# EAGLE design classdamp (EAGLE 6.4)
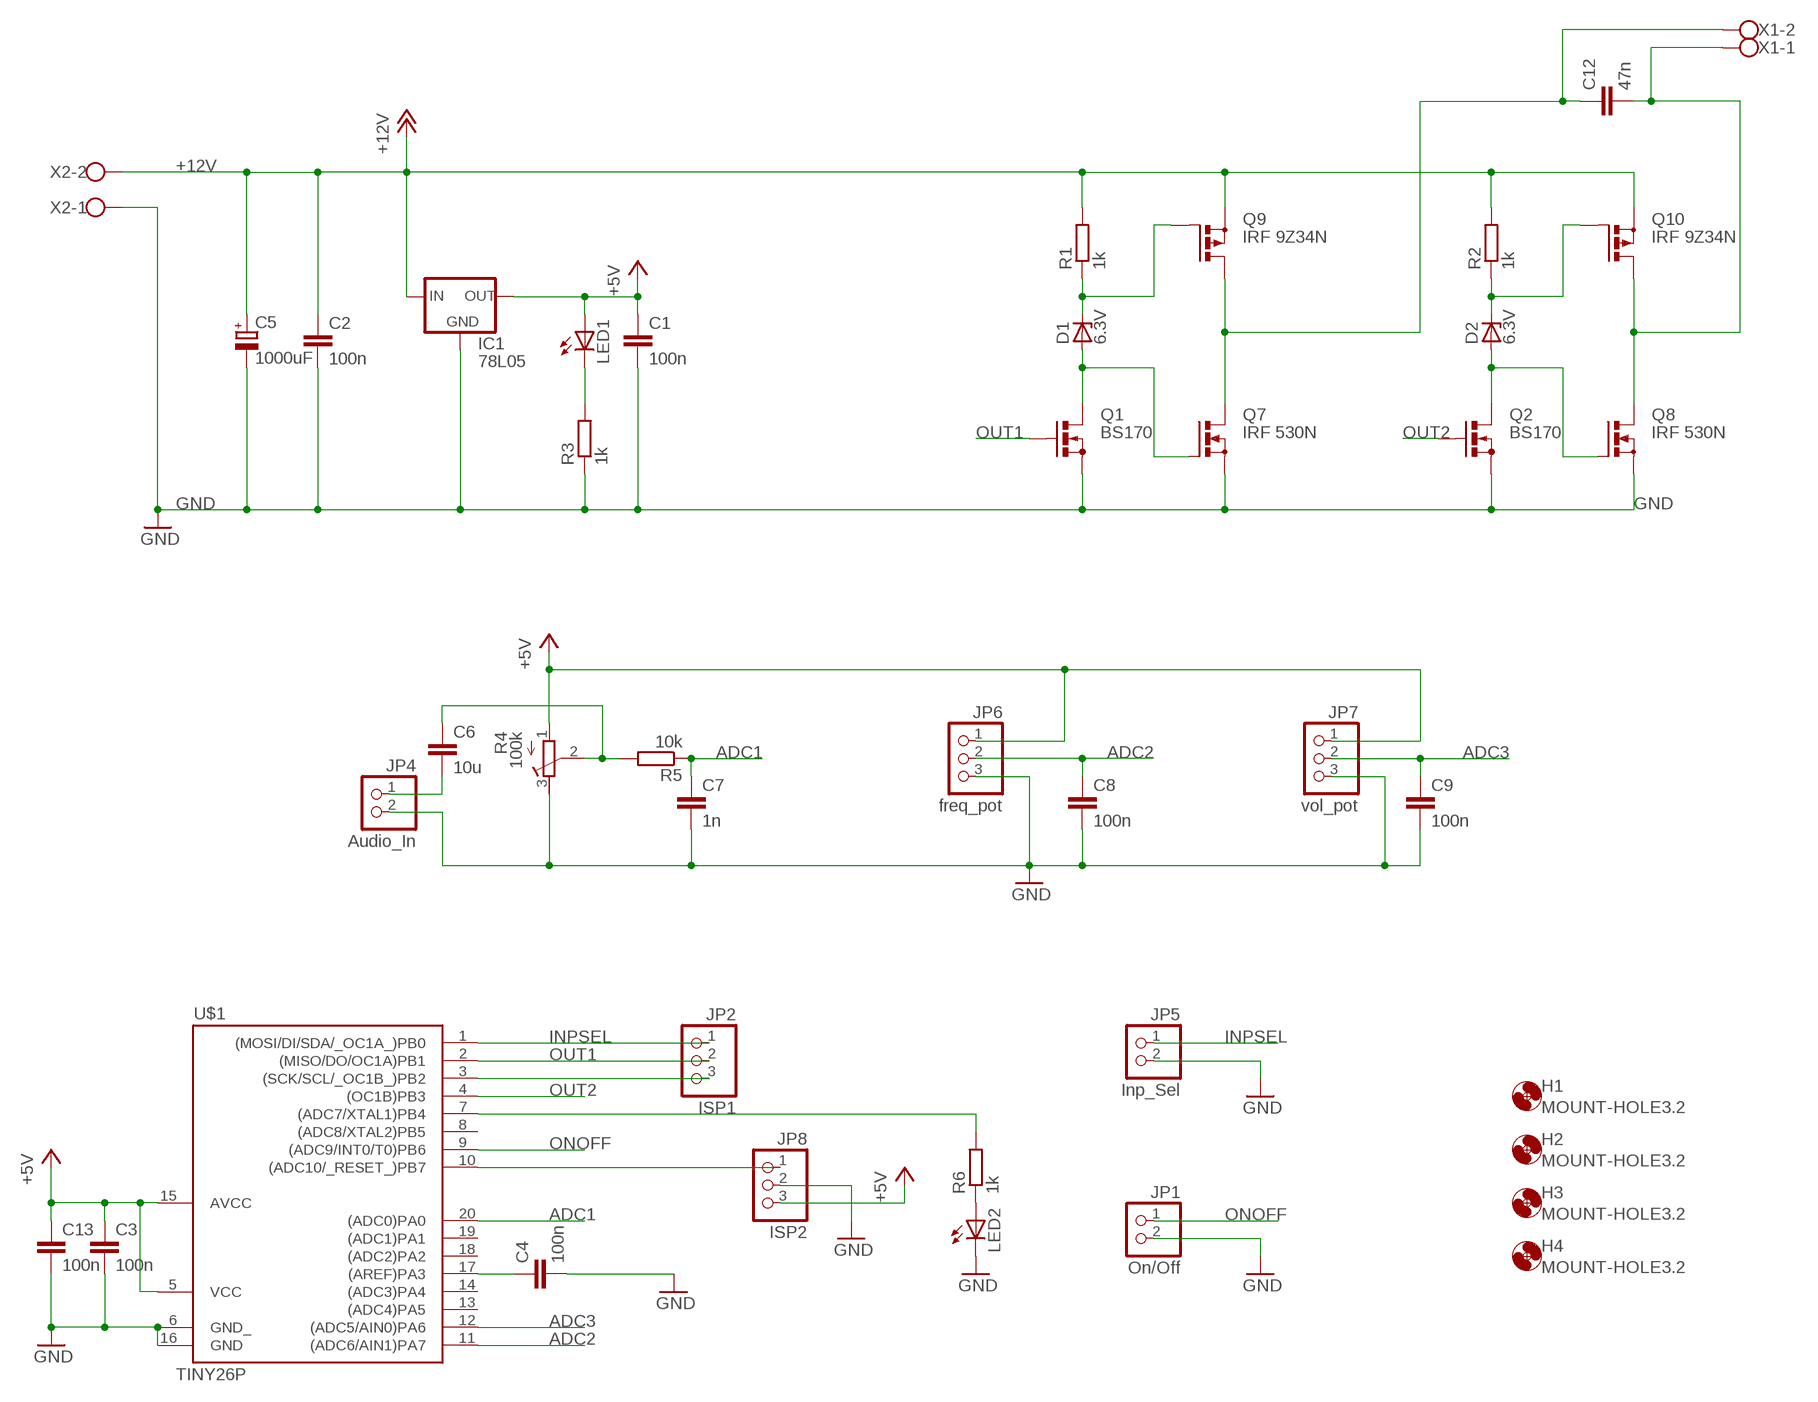
[diagram p0: schematic, sheet 1]

## Parts
C1  100n  C-EUC0805K  [C0805K]
C2  100n  C-EUC0805K  [C0805K]
C3  100n  C-EUC0805K  [C0805K]
C4  100n  C-EUC0805K  [C0805K]
C5  1000uF  CPOL-EUE5-8.5  [E5-8,5]
C6  10u  C-EUC0805K  [C0805K]
C7  1n  C-EUC0805K  [C0805K]
C8  100n  C-EUC0805K  [C0805K]
C9  100n  C-EUC0805K  [C0805K]
C12  47n  C5/3.5  [C5B3.5]
C13  100n  C-EUC0805K  [C0805K]
D1  6.3V  ZENER-DIODEZD-5  [ZDIO-5]
D2  6.3V  ZENER-DIODEZD-5  [ZDIO-5]
H1  MOUNT-HOLE3.2  [3,2]
H2  MOUNT-HOLE3.2  [3,2]
H3  MOUNT-HOLE3.2  [3,2]
H4  MOUNT-HOLE3.2  [3,2]
IC1  78L05  78LXX  [78LXX]
JP1  On/Off  PINHD-1X2  [1X02]
JP2  ISP1  PINHD-1X3  [1X03]
JP4  Audio_In  PINHD-1X2  [1X02]
JP5  Inp_Sel  PINHD-1X2  [1X02]
JP6  freq_pot  PINHD-1X3  [1X03]
JP7  vol_pot  PINHD-1X3  [1X03]
JP8  ISP2  PINHD-1X3  [1X03]
LED1  LEDSML0805  [SML0805]
LED2  LEDSML0805  [SML0805]
Q1  BS170  [SOT54E]
Q2  BS170  [SOT54E]
Q7  IRF 530N  PMOSFET_NTO220BV  [TO220BV]
Q8  IRF 530N  PMOSFET_NTO220BV  [TO220BV]
Q9  IRF 9Z34N  PMOSFET_PTO220BV  [TO220BV]
Q10  IRF 9Z34N  PMOSFET_PTO220BV  [TO220BV]
R1  1k  R-EU_R0805  [R0805]
R2  1k  R-EU_R0805  [R0805]
R3  1k  R-EU_R0805  [R0805]
R4  100k  R-TRIMM64W  [RTRIM64W]
R5  10k  R-EU_R0805  [R0805]
R6  1k  R-EU_R0805  [R0805]
U$1  TINY26P  [DIL20]
X1  W237-102  [W237-102]
X2  W237-102  [W237-102]

## Nets
+5V: C1.1 C3.1 C13.1 IC1.OUT JP6.1 JP7.1 JP8.3 LED1.A R4.1(E) U$1.5(VCC) U$1.15(AVCC)
+12V: C2.1 C5.+ IC1.IN Q9.S Q10.S R1.2 R2.2 X2.2
ADC1: C7.1 R5.1 U$1.20((ADC0)PA0)
ADC2: C8.1 JP6.2 U$1.11((ADC6/AIN1)PA7)
ADC3: C9.1 JP7.2 U$1.12((ADC5/AIN0)PA6)
GND: C1.2 C2.2 C3.2 C4.2 C5.- C7.2 C8.2 C9.2 C13.2 IC1.GND JP1.2 JP4.2 JP5.2 JP6.3 JP7.3 JP8.2 LED2.C Q1.S Q2.S Q7.S Q8.S R3.1 R4.3(A) U$1.6(GND_) U$1.16(GND) X2.1
INPSEL: JP2.1 JP5.1 U$1.1((MOSI/DI/SDA/_OC1A_)PB0)
N$1: LED1.C R3.2
N$2: C4.1 U$1.17((AREF)PA3)
N$3: LED2.A R6.1
N$4: D1.A Q1.D Q7.G
N$5: D2.A Q2.D Q8.G
N$6: D1.C Q9.G R1.1
N$7: D2.C Q10.G R2.1
N$8: C6.2 JP4.1
N$9: JP2.3 U$1.3((SCK/SCL/_OC1B_)PB2)
N$10: C6.1 R4.2(S) R5.2
N$11: C12.1 Q7.D Q9.D X1.2
N$12: JP8.1 U$1.10((ADC10/_RESET_)PB7)
N$13: C12.2 Q8.D Q10.D X1.1
N$14: R6.2 U$1.7((ADC7/XTAL1)PB4)
ONOFF: JP1.1 U$1.9((ADC9/INT0/T0)PB6)
OUT1: JP2.2 Q1.G U$1.2((MISO/DO/OC1A)PB1)
OUT2: Q2.G U$1.4((OC1B)PB3)
Unconnected: U$1.8((ADC8/XTAL2)PB5) U$1.13((ADC4)PA5) U$1.14((ADC3)PA4) U$1.18((ADC2)PA2) U$1.19((ADC1)PA1)

## Library data of the parts
C1-C4 C6-C9 C13 = resistor:C-EU: CAPACITOR, European symbol
C5 = resistor:CPOL-EU: POLARIZED CAPACITOR, European symbol
C12 = capacitor-wima:C: CAPACITOR naming: grid - package width
D1 D2 = diode:ZENER-DIODE: Z-Diode
H1-H4 = holes:MOUNT-HOLE: MOUNTING HOLE with drill center marker
IC1 = v-reg:78LXX: VOLTAGE REGULATOR
JP1 JP4 JP5 = pinhead:PINHD-1X2: PIN HEADER
JP2 JP6-JP8 = pinhead:PINHD-1X3: PIN HEADER
LED1 LED2 = led:LED: LED OSRAM: - CHIPLED LG R971, LG N971, LY N971, LG Q971, LY Q971, LO R971, LY R971 LH N974, LH R974 LS Q976, LO Q976, LY Q976 LO Q996 - Hyper CHIPLED LW Q18S LB Q993, LB Q99A, LB R99A - SideLED LS A670, LO A670, LY A670, LG A670, LP A670 LB A673, LV A673, LT A673, LW A673 LH A674 LY A675 LS A676, LA A676, LO A676, LY A676, LW A676 LS A679, LY A679, LG A679 - Hyper Micro SIDELED® LS Y876, LA Y876, LO Y876, LY Y876 LT Y87S - SmartLED LW L88C, LW L88S LB L89C, LB L89S, LG L890 LS L89K, LO L89K, LY L89K LS L896, LA L896, LO L896, LY L896 - TOPLED LS T670, LO T670, LY T670, LG T670, LP T670 LSG T670, LSP T670, LSY T670, LOP T670, LYG T670 LG T671, LOG T671, LSG T671 LB T673, LV T673, LT T673, LW T673 LH T674 LS T676, LA T676, LO T676, LY T676, LB T676, LH T676, LSB T676, LW T676 LB T67C, LV T67C, LT T67C, LS T67K, LO T67K, LY T67K, LW E67C LS E67B, LA E67B, LO E67B, LY E67B, LB E67C, LV E67C, LT E67C LW T67C LS T679, LY T679, LG T679 LS T770, LO T770, LY T770, LG T770, LP T770 LB T773, LV T773, LT T773, LW T773 LH T774 LS E675, LA E675, LY E675, LS T675 LS T776, LA T776, LO T776, LY T776, LB T776 LHGB T686 LT T68C, LB T68C - Hyper Mini TOPLED® LB M676 - Mini TOPLED Santana® LG M470 LS M47K, LO M47K, LY M47K Source: http://www.osram.convergy.de LUXEON: - LUMILED® LXK2-PW12-R00, LXK2-PW12-S00, LXK2-PW14-U00, LXK2-PW14-V00 LXK2-PM12-R00, LXK2-PM12-S00, LXK2-PM14-U00 LXK2-PE12-Q00, LXK2-PE12-R00, LXK2-PE12-S00, LXK2-PE14-T00, LXK2-PE14-U00 LXK2-PB12-K00, LXK2-PB12-L00, LXK2-PB12-M00, LXK2-PB14-N00, LXK2-PB14-P00, LXK2-PB14-Q00 LXK2-PR12-L00, LXK2-PR12-M00, LXK2-PR14-Q00, LXK2-PR14-R00 LXK2-PD12-Q00, LXK2-PD12-R00, LXK2-PD12-S00 LXK2-PH12-R00, LXK2-PH12-S00 LXK2-PL12-P00, LXK2-PL12-Q00, LXK2-PL12-R00 Source: www.luxeon.com KINGBRIGHT: KA-3528ASYC Source: www.kingbright.com
Q1 Q2 = transistor-small-signal:BS170: N-CHANNEL MOS FET
Q7 Q8 = transistor-power:PMOSFET_N: Power MOSFET N-Channel
Q9 Q10 = transistor-power:PMOSFET_P: Power MOSFET P-Channel
R1-R3 R5 R6 = resistor:R-EU_: RESISTOR, European symbol
R4 = resistor:R-TRIMM: Trimm resistor
U$1 = avr-7:TINY26: Atmel Tiny26/261/461/861
X1 X2 = con-wago-500:W237-102: WAGO SCREW CLAMP; MPN: 237-102; OC_FARNELL: unknown; OC_NEWARK: 70K9898

## Board
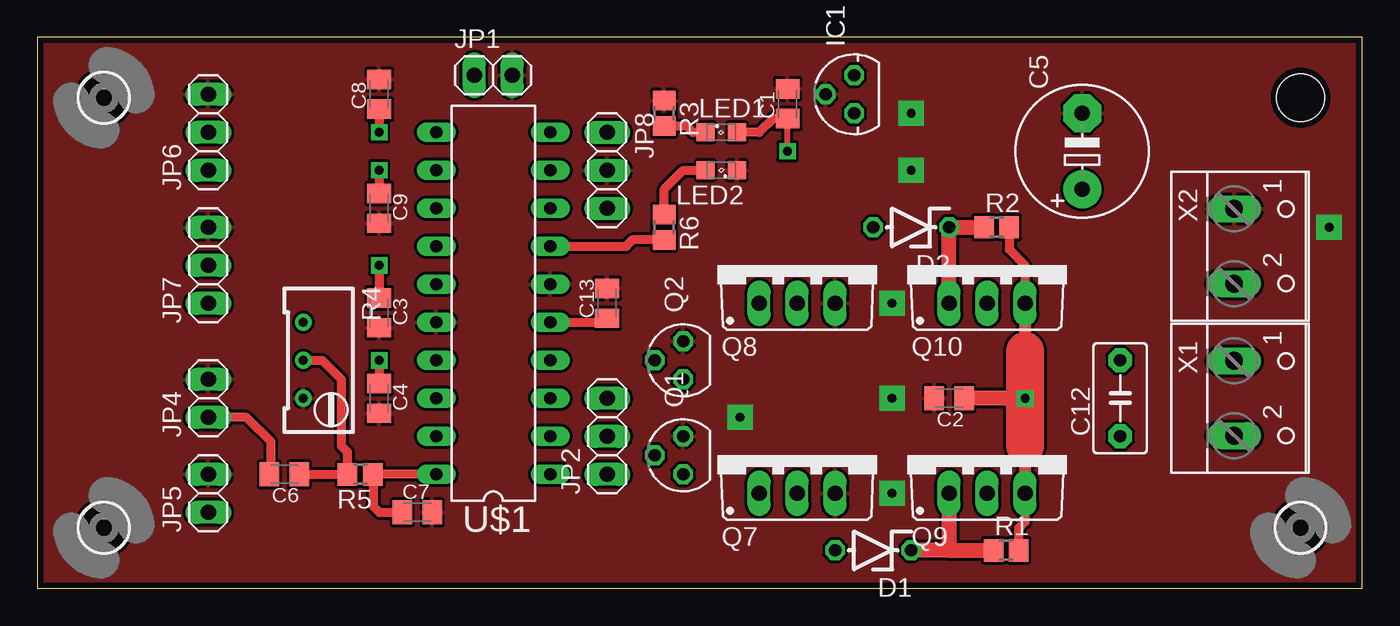
[diagram p1: board, top side]
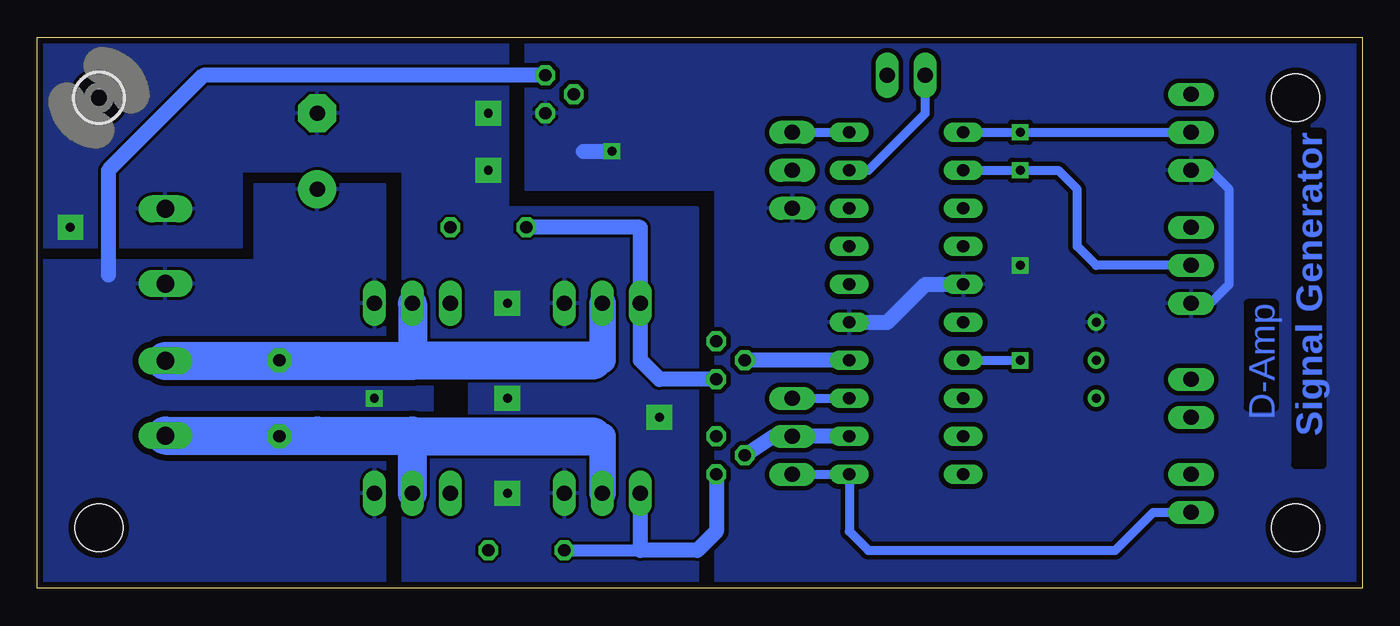
[diagram p2: board, bottom side, seen from below]

Size 88.57 x 36.82 mm. Coordinates in mm from the lower left corner, seen from the top.
Outline: 0,0 88.57,0 88.57,36.82 0,36.82 0,0
Copper layers (1*16): Top 0.035mm / dielectric 1.5mm / Bottom 0.035mm
Design rules "pcb-devboards_Standard": minimum track width 0.2mm, minimum drill 0.4mm, track to track 0.2mm, track to pad 0.2mm, pad to pad 0.2mm, via to via 0.2mm, smd to smd 0.2mm, copper to edge 0.4mm, drill to drill 0.2mm, minimum pad ring 0.25mm, minimum via ring 0.25mm, stop-mask expansion 0.1mm, vias tented up to drill 0mil, thermal gap 0.2mm

### Footprints (pad centres in the part's own frame; a part is rotated, then mirrored left to right if it is on the bottom)
C0805K = smd 1.3 x 1.6: 1 -1,0; 2 1,0
E5-8,5 = drill 1.016 pad 2.54: + -2.54,0 | drill 1.016 pad 2.54 octagon: - 2.54,0
C5B3.5 = drill 0.813 pad 1.6 octagon: 1 -2.54,0; 2 2.54,0
ZDIO-5 = drill 0.813 octagon: A 2.54,0; C -2.54,0
3,2 = hole 3.2: 0,0
78LXX = drill 0.813 octagon: GND 0,1.905; IN 1.27,0; OUT -1.27,0
1X02 = drill 1.016 long: 1 -1.27,0; 2 1.27,0
1X03 = drill 1.016 long: 1 -2.54,0; 2 0,0; 3 2.54,0
SML0805 = smd 1.2 x 1.2: A 1.05,0; C -1.05,0
SOT54E = drill 0.813 octagon: D -1.27,0; G 0,1.905; S 1.27,0
TO220BV = drill 1.016 long: D 0,-2.54; G -2.54,-2.54; S 2.54,-2.54
R0805 = smd 1.3 x 1.5: 1 -0.85,0; 2 0.85,0
RTRIM64W = drill 0.61: 1 1.27,-2.54; 2 1.27,0; 3 1.27,2.54
DIL20 = drill 0.813 long: 1 -11.43,-3.81; 2 -8.89,-3.81; 3 -6.35,-3.81; 4 -3.81,-3.81; 5 -1.27,-3.81; 6 1.27,-3.81; 7 3.81,-3.81; 8 6.35,-3.81; 9 8.89,-3.81; 10 11.43,-3.81; 11 11.43,3.81; 12 8.89,3.81; 13 6.35,3.81; 14 3.81,3.81; 15 1.27,3.81; 16 -1.27,3.81; 17 -3.81,3.81; 18 -6.35,3.81; 19 -8.89,3.81; 20 -11.43,3.81
W237-102 = drill 1.194 long: 1 -2.5,-1.27; 2 2.5,-1.27

### Placement (x,y rotation side)
C1  50.16,32.38 90 top
C2  60.96,12.7 180 top
C3  22.86,18.41 270 top
C4  22.86,12.7 270 top
C5  69.85,29.21 90 top
C6  16.51,7.62 180 top
C7  25.4,5.08 0 top
C8  22.86,33.02 90 top
C9  22.86,25.4 270 top
C12  72.39,12.7 90 top
C13  38.1,19.05 90 top
D1  55.88,2.54 180 top
D2  58.42,24.13 180 top
H1  4.45,32.78 0 top
H2  84.45,32.78 0 bottom
H3  84.45,4.04 0 top
H4  4.45,4.04 0 top
IC1  54.61,33.02 90 top
JP1  30.48,34.29 0 top
JP2  38.1,10.16 90 top
JP4  11.43,12.7 90 top
JP5  11.43,6.35 90 top
JP6  11.43,30.48 90 top
JP7  11.43,21.59 90 top
JP8  38.1,27.94 270 top
LED1  45.72,30.48 0 top
LED2  45.72,27.94 180 top
Q1  43.18,8.89 90 top
Q2  43.18,15.24 90 top
Q7  50.8,8.89 0 top
Q8  50.8,21.59 0 top
Q9  63.5,8.89 0 top
Q10  63.5,21.59 0 top
R1  64.77,2.54 0 top
R2  64.14,24.13 0 top
R3  41.91,31.75 270 top
R4  19.05,15.24 180 top
R5  21.59,7.62 180 top
R6  41.91,24.13 270 top
U$1  30.48,19.05 90 top
X1  81.28,12.7 270 top
X2  81.28,22.86 270 top

### Tracks (layer width: path | path; a pad name or v marks a point on that pad's centre or on a via)
+5V  (via drill 0.6, 0.6 pad 1.02)
  Top 0.406: v50.16,29.21 C1.1
  Top 0.61: U$1.5 38.1,17.78 C13.1 | v22.86,21.59 C3.1 | C1.1 49.16,31.39 48.26,30.48 LED1.A
  Bottom 0.61: JP7.1 10.16,19.05 8.89,20.32 8.89,26.67 10.16,27.94 JP6.1
  Bottom 1.016: U$1.5 31.75,17.78 29.21,20.32 U$1.15 | 52.07,29.21 v50.16,29.21
  pour Bottom (isolate 0.305): 55.88,26.67 55.88,38.1 0,38.1 0,0 43.18,0 43.18,26.67
+12V  (via drill 0.6 pad 1.02)
  Top 0.61: v66.04,12.7 64.77,12.7 | Q9.S 66.04,4.45 65.62,4.03 R1.2 | R2.2 64.98,22.64 66.04,21.59 Q10.S
  Top 0.813: Q10.S 66.04,15.88 | 66.04,9.53 Q9.S
  Top 1.016: 64.77,12.7 C2.1
  Top 2.54: 66.04,15.88 v66.04,12.7 66.04,9.53
  Bottom 1.016: 83.82,20.95 83.82,27.94 77.47,34.29 IC1.IN
  pour Bottom (isolate 0.406): 65.41,26.99 65.41,13.97 62.23,13.97 62.23,11.43 65.41,11.43 65.41,0 88.27,0 88.27,21.91 73.98,21.91 73.98,26.99
ADC1
  Top 0.61: C7.1 22.86,5.08 22.44,5.5 R5.1 U$1.20
ADC2  (via drill 0.6)
  Top 0.61: C8.1 v22.86,30.48
  Bottom 0.61: U$1.11 v22.86,30.48 JP6.2
ADC3  (via drill 0.6)
  Top 0.61: v22.86,27.94 C9.1
  Bottom 0.61: U$1.12 v22.86,27.94 20.32,27.94 19.05,26.67 19.05,22.86 17.78,21.59 JP7.2
GND  (via drill 0.6 pad 1.68)
  other vias: 57.15,19.05 57.15,6.35 58.42,31.75 58.42,27.94 46.99,11.43 86.36,24.13 57.15,12.7
  pour Top: 0,36.83 88.27,36.83 88.27,0 0,0
  pour Bottom: 57.15,36.83 88.9,36.83 88.9,22.86 74.93,22.86 74.93,27.94 64.14,27.94 64.14,15.24 59.69,15.24 59.69,10.16 64.14,10.16 64.14,0 44.45,0 44.45,25.4 57.15,25.4
INPSEL
  Bottom 0.61: JP2.1 U$1.1 34.29,3.81 33.02,2.54 16.51,2.54 13.97,5.08 JP5.1
N$1
  Top 0.61: LED1.C 43.81,30.48 43.4,30.9 R3.2
N$2  (via drill 0.6)
  Top 0.61: v22.86,15.24 C4.1
  Bottom 0.61: U$1.17 v22.86,15.24
N$3
  Top 0.61: R6.1 41.91,26.67 43.18,27.94 LED2.A
N$4
  Bottom 0.813: D1.A 48.26,2.54
  Bottom 1.016: Q7.G 48.26,2.54 44.45,2.54 43.18,3.81 Q1.D
N$5
  Bottom 1.016: D2.A 48.26,24.13 Q8.G 48.26,15.24 46.99,13.97 Q2.D
N$6
  Top 1.016: 60.96,2.54 R1.1 | Q9.G 60.96,2.54 | 60.96,2.54 D1.C
N$7
  Top 1.016: Q10.G D2.C R2.1
N$8
  Top 0.61: JP4.1 13.97,11.43 15.62,9.78 15.62,7.62 C6.2
N$9
  Bottom 0.61: JP2.3 U$1.3
N$10
  Top 0.61: R4.2 19.05,15.24 20.32,13.97 20.32,9.53 20.74,9.11 R5.2 C6.1
N$11
  Bottom 1.27: 63.5,10.2 63.5,10.16
  Bottom 1.778: 51.44,10.16 50.8,10.16 Q7.D | C12.1 69.85,10.2
  Bottom 1.93: Q9.D 63.5,10.16
  Bottom 2.54: X1.2 69.85,10.2 63.5,10.2 | 63.5,10.16 51.44,10.16
N$12
  Bottom 0.61: JP8.1 U$1.10
N$13
  Bottom 1.27: 63.5,15.2 63.5,15.24
  Bottom 1.778: 51.44,15.24 50.8,15.24 Q8.D | C12.2 69.85,15.2
  Bottom 1.93: Q10.D 63.5,15.24
  Bottom 2.54: X1.1 69.85,15.2 63.5,15.2 | 63.5,15.24 51.44,15.24
N$14
  Top 0.61: U$1.7 39.37,22.86 39.79,23.28 R6.2
ONOFF
  Bottom 0.61: U$1.9 33.02,27.94 29.21,31.75 JP1.1
OUT1
  Bottom 1.016: U$1.2 JP2.2 39.37,10.16 Q1.G
OUT2
  Bottom 1.016: U$1.4 Q2.G

### Text on the board
Bottom: Signal Generator | D-Amp